# EAGLE design untitled (EAGLE 6.1)
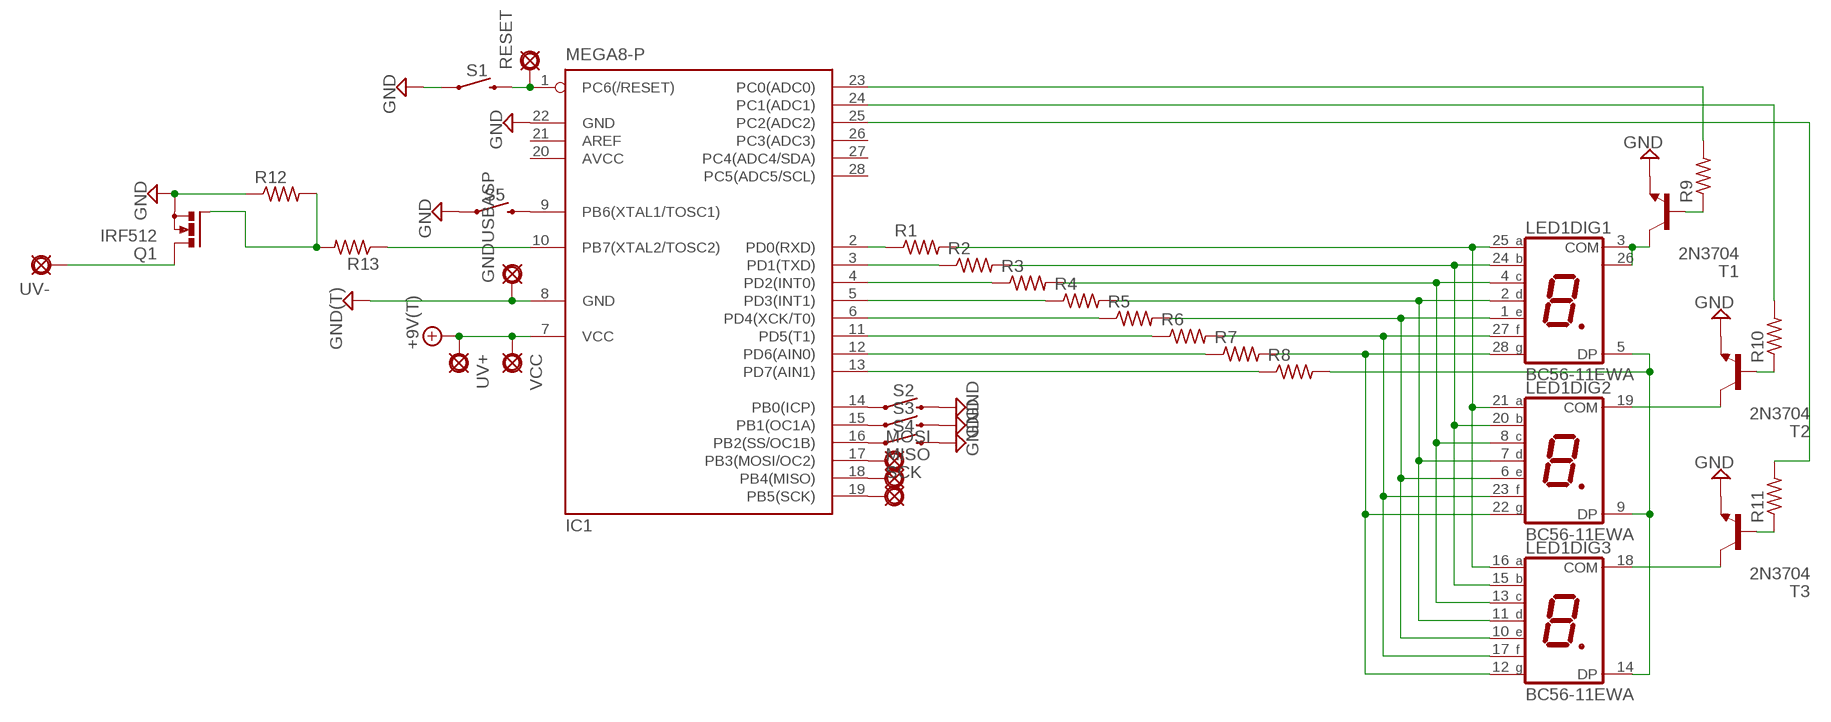
[diagram p0: schematic, sheet 1]

## Parts
+9V1  +9V(T)  [SQUARE]
GND1  GND(T)  [SQUARE]
GNDUSBASP  PAD  [SQUARE]
IC1  MEGA8-P  [DIL28-3]
LED1  BC56-11EWA  [BA/BC56]
MISO  PAD  [SQUARE]
MOSI  PAD  [SQUARE]
Q1  IRF512  [TO220BV]
R1  6MM.3  [R0207/3]
R2  6MM.3  [R0207/3]
R3  6MM.3  [R0207/3]
R4  6MM.3  [R0207/3]
R5  6MM.3  [R0207/3]
R6  6MM.3  [R0207/3]
R7  6MM.3  [R0207/3]
R8  6MM.3  [R0207/3]
R9  6MM.3  [R0207/3]
R10  6MM.3  [R0207/3]
R11  6MM.3  [R0207/3]
R12  6MM.3  [R0207/3]
R13  6MM.3  [R0207/3]
RESET  PAD  [SQUARE]
S1  MOMENTARY-SWITCH-SPST-PTH-6.0MM  [TACTILE_SWITCH_PTH_6.0MM]
S2  MOMENTARY-SWITCH-SPST-PTH-6.0MM  [TACTILE_SWITCH_PTH_6.0MM]
S3  MOMENTARY-SWITCH-SPST-PTH-6.0MM  [TACTILE_SWITCH_PTH_6.0MM]
S4  MOMENTARY-SWITCH-SPST-PTH-6.0MM  [TACTILE_SWITCH_PTH_6.0MM]
S5  MOMENTARY-SWITCH-SPST-PTH-6.0MM  [TACTILE_SWITCH_PTH_6.0MM]
SCK  PAD  [SQUARE]
T1  2N3704  [TO92]
T2  2N3704  [TO92]
T3  2N3704  [TO92]
UV+  PAD  [SQUARE]
UV-  PAD  [SQUARE]
VCC  PAD  [SQUARE]

## Nets
+9V: +9V1.1(+9V) IC1.7(VCC) UV+.1(PAD) VCC.1(PAD)
GND: GND1.1(GND) GNDUSBASP.1(PAD) IC1.8(GND) IC1.22(GND) Q1.S R12.1 S1.1 S2.3 S3.3 S4.3 S5.1 T1.3(E) T2.3(E) T3.3(E)
N$1: LED1.16(DIG3:A) LED1.21(DIG2:A) LED1.25(DIG1:A) R1.2
N$2: LED1.15(DIG3:B) LED1.20(DIG2:B) LED1.24(DIG1:B) R2.2
N$3: LED1.4(DIG1:C) LED1.8(DIG2:C) LED1.13(DIG3:C) R3.2
N$4: LED1.2(DIG1:D) LED1.7(DIG2:D) LED1.11(DIG3:D) R4.2
N$5: LED1.1(DIG1:E) LED1.6(DIG2:E) LED1.10(DIG3:E) R5.2
N$6: LED1.17(DIG3:F) LED1.23(DIG2:F) LED1.27(DIG1:F) R6.2
N$7: LED1.5(DIG1:DP) LED1.9(DIG2:DP) LED1.14(DIG3:DP) R8.2
N$8: LED1.12(DIG3:G) LED1.22(DIG2:G) LED1.28(DIG1:G) R7.2
N$9: LED1.3(DIG1:COM) LED1.26(DIG1:COM) T1.2(C)
N$10: LED1.19(DIG2:COM) T2.2(C)
N$11: LED1.18(DIG3:COM) T3.2(C)
N$12: IC1.2(PD0(RXD)) R1.1
N$13: IC1.3(PD1(TXD)) R2.1
N$14: IC1.4(PD2(INT0)) R3.1
N$15: IC1.5(PD3(INT1)) R4.1
N$16: IC1.6(PD4(XCK/T0)) R5.1
N$17: IC1.11(PD5(T1)) R6.1
N$18: IC1.12(PD6(AIN0)) R7.1
N$19: IC1.13(PD7(AIN1)) R8.1
N$20: R9.1 T1.1(B)
N$21: R10.1 T2.1(B)
N$22: R11.1 T3.1(B)
N$23: IC1.23(PC0(ADC0)) R9.2
N$24: IC1.24(PC1(ADC1)) R10.2
N$25: IC1.25(PC2(ADC2)) R11.2
N$26: IC1.1(PC6(/RESET)) RESET.1(PAD) S1.3
N$27: IC1.14(PB0(ICP)) S2.1
N$28: IC1.15(PB1(OC1A)) S3.1
N$29: IC1.16(PB2(SS/OC1B)) S4.1
N$30: IC1.9(PB6(XTAL1/TOSC1)) S5.3
N$31: IC1.17(PB3(MOSI/OC2)) MOSI.1(PAD)
N$32: IC1.18(PB4(MISO)) MISO.1(PAD)
N$33: IC1.19(PB5(SCK)) SCK.1(PAD)
N$34: IC1.10(PB7(XTAL2/TOSC2)) R13.1
N$35: Q1.G R12.2 R13.2
N$37: Q1.D UV-.1(PAD)
Unconnected: IC1.21(AREF) IC1.26(PC3(ADC3)) IC1.27(PC4(ADC4/SDA)) IC1.28(PC5(ADC5/SCL))

## Power pins joined to a net without a drawn wire
AVCC: IC1.20(AVCC)

## Library data of the parts
+9V1 = gm-supply:+9V(T): +9V Voltage Supply use this to hook up +9v throughout a schematic instead of running wire automatically labels the net "+9v" adds a hookup pad to the circuit board
GND1 = gm-supply:GND(T): Ground use this to hook up ground (GND) throughout a schematic instead of running wire automatically labels the net "GND" adds a hookup pad to the circuit board (you can use several)
GNDUSBASP MISO MOSI RESET SCK UV+ UV- VCC = gm-supply:PAD: PAD use this package for pads with any purpose, including input, output, send or return various pad shapes: round, square, octogonal, long, and long offset
IC1 = atmel:MEGA8-P: MICROCONTROLLER 8 Kbytes FLASH, 1 kbytes SRAM, 512 bytes EEPROM, USART, 4-channel 10 bit ADC, 2-channel 8 bit ADC Pin compatible with Atmega48, ATMega88, ATMega168 Source: avr.lbr; OC_FARNELL: unknown; OC_NEWARK: unknown
LED1 = display-kingbright:B?56-11*WA: 14.22mm (0.56INCH) THREE DIGIT NUMERIC DISPLAY Source: http://www.kingbright.com .. BA56-11EWA(Ver1189474895.pdf; OC_FARNELL: unknown; OC_NEWARK: unknown
Q1 = transistor-power:IRF512: N-CHANNEL MOS FET
R1-R13 = gm-resistors:6MM: 6mm Resistors Leads spaced 1-6 holes apart for 0.1" perfboard. Suitable for 1/4 watt resistors.
S1-S5 = SparkFun-Switches:MOMENTARY-SWITCH-SPST: Momentary Switch (Pushbutton) - SPST Normally-open (NO) SPST momentary switches (buttons, pushbuttons). Variants PTH-12MM - 12mm square, through-hole Momentary Pushbutton Switch - 12mm Square <https://www.sparkfun.com/products/9190> (COM-09190) PTH-6.0MM, PTH-6.0MM-KIT - 6.0mm square, through-hole Mini Pushbutton Switch <https://www.sparkfun.com/products/97> (COM-00097) KIT package intended for soldering kit's - only one side of pads' copper is exposed. PTH-RIGHT-ANGLE-KIT - Right-angle, through-hole Right Angle Tactile Button <https://www.sparkfun.com/products/10791> - Used on SparkFun BigTime Watch Kit <https://www.sparkfun.com/products/11734> SMD-12MM - 12mm square, surface-mount Tactile Button - SMD (12mm) <https://www.sparkfun.com/products/12993> (COM-12993) Used on SparkFun PicoBoard <https://www.sparkfun.com/products/11888> SMD-4.5MM - 4.5mm Square Trackball Switch Used on SparkFun Blackberry Trackballer Breakout <https://www.sparkfun.com/products/13169> SMD-4.6MMX2.8MM - 4.60mm x 2.80mm, surface mount Used on SparkFun SAMD21 Mini Breakout <https://www.sparkfun.com/products/13664> SMD-5.2MM, SMD-5.2-REDUNDANT - 5.2mm square, surface-mount Mini Pushbutton Switch - SMD <https://www.sparkfun.com/products/8720> (COM-08720) Used on Arduino Pro Mini <https://www.sparkfun.com/products/11114> REDUNDANT package connects both switch circuits together SMD-6.0X3.5MM - 6.0 x 3.5mm, surface mount Momentary Reset Switch SMD <https://www.sparkfun.com/products/8229> (COM-08229) SMD-6.2MM-TALL - 6.2mm square, surface mount Tactile Button - SMD (6mm) <https://www.sparkfun.com/products/12992> Used on SparkFun Digital Sandbox <https://www.sparkfun.com/products/12651> SMD-RIGHT-ANGLE - Right-angle, surface mount Used on SparkFun Block for Intel® Edison - Arduino <https://www.sparkfun.com/products/13036>; PROD_ID: SWCH-08441; SF_SKU: COM-00097
T1-T3 = transistor:2N3704: NPN TRANSISTOR

## Board
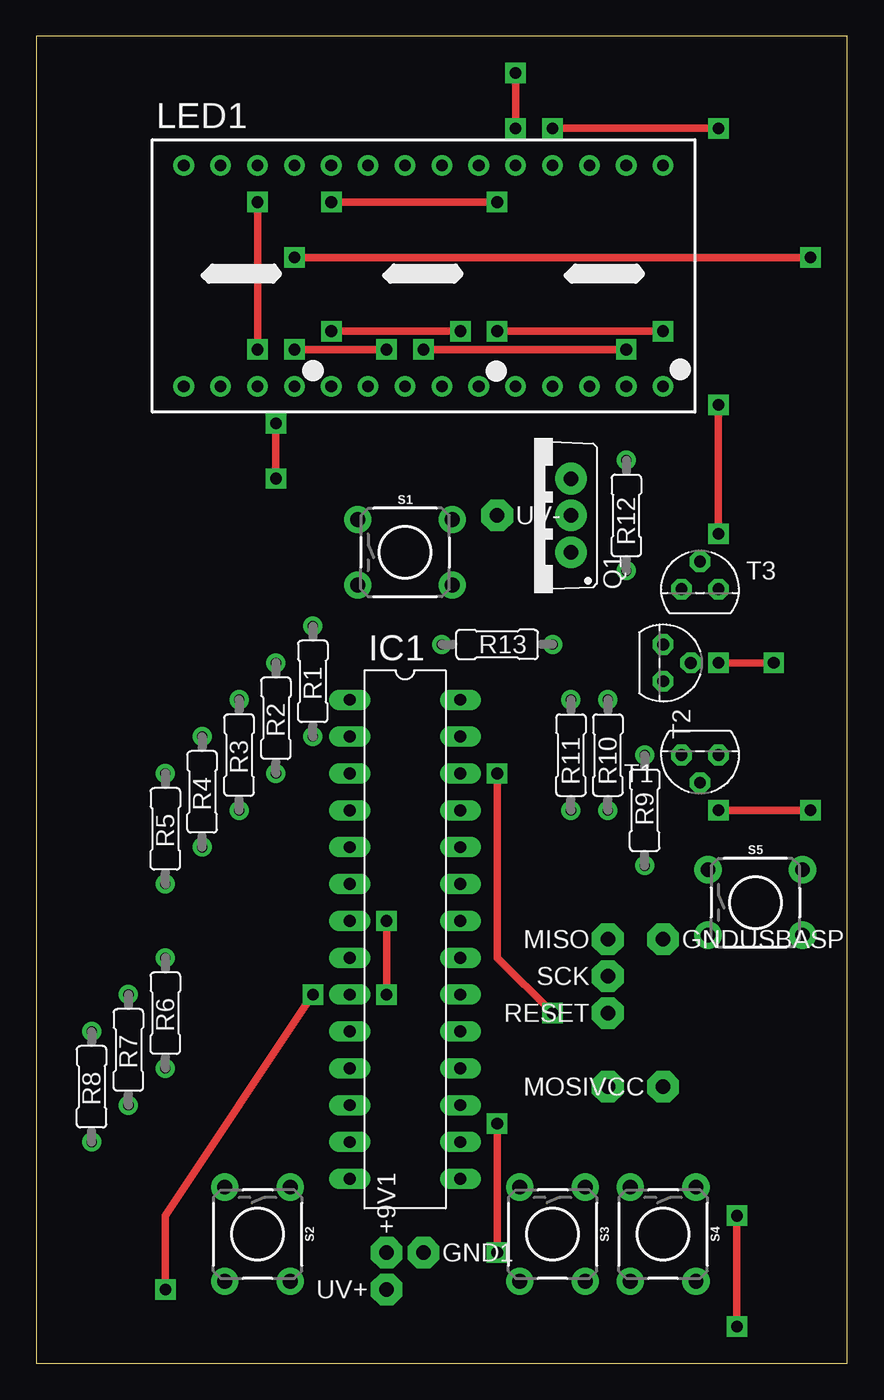
[diagram p1: board, top side]
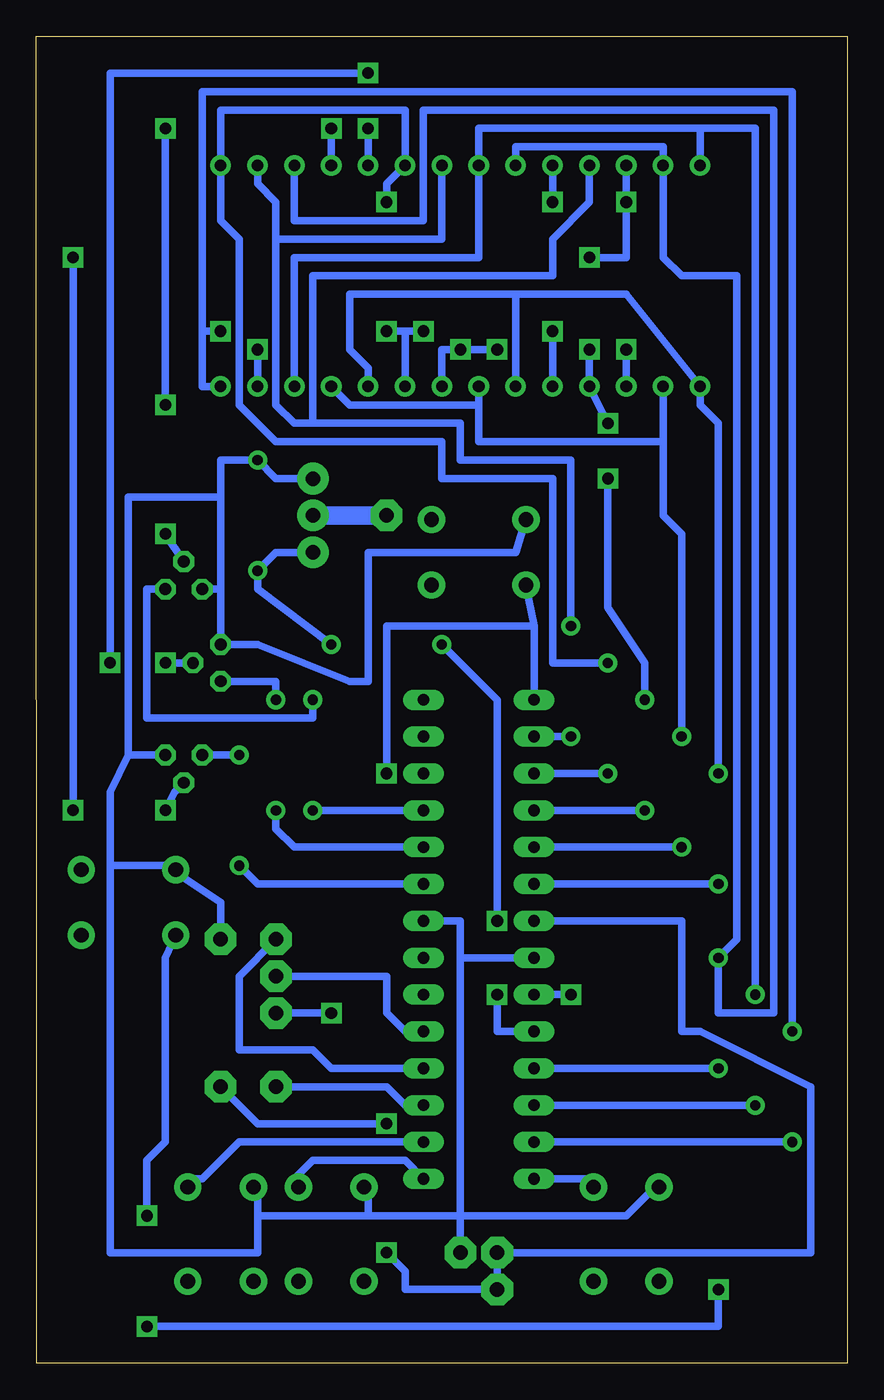
[diagram p2: board, bottom side, seen from below]

Size 55.88 x 91.44 mm. Coordinates in mm from the lower left corner, seen from the top.
Outline: 0,0 55.86,0 55.88,91.44 0,91.44 0,0
Copper layers (1*16): Top 0.035mm / dielectric 1.5mm / Bottom 0.035mm
Design rules: minimum track width 20mil, minimum drill 24mil, track to track 8mil, track to pad 8mil, pad to pad 8mil, via to via 8mil, smd to smd 8mil, copper to edge 20mil, drill to drill 40mil, minimum pad ring 12mil, minimum via ring 12mil, stop-mask expansion 4mil, vias tented up to drill 0mil, thermal gap 10mil

### Footprints (pad centres in the part's own frame; a part is rotated, then mirrored left to right if it is on the bottom)
SQUARE = drill 1 pad 2.18 octagon: 1 0,0
DIL28-3 = drill 0.813 long: 1 -16.51,-3.81; 2 -13.97,-3.81; 3 -11.43,-3.81; 4 -8.89,-3.81; 5 -6.35,-3.81; 6 -3.81,-3.81; 7 -1.27,-3.81; 8 1.27,-3.81; 9 3.81,-3.81; 10 6.35,-3.81; 11 8.89,-3.81; 12 11.43,-3.81; 13 13.97,-3.81; 14 16.51,-3.81; 15 16.51,3.81; 16 13.97,3.81; 17 11.43,3.81; 18 8.89,3.81; 19 6.35,3.81; 20 3.81,3.81; 21 1.27,3.81; 22 -1.27,3.81; 23 -3.81,3.81; 24 -6.35,3.81; 25 -8.89,3.81; 26 -11.43,3.81; 27 -13.97,3.81; 28 -16.51,3.81
BA/BC56 = drill 0.8 pad 1.422: 1 -16.51,-7.62; 2 -13.97,-7.62; 3 -11.43,-7.62; 4 -8.89,-7.62; 5 -6.35,-7.62; 6 -3.81,-7.62; 7 -1.27,-7.62; 8 1.27,-7.62; 9 3.81,-7.62; 10 6.35,-7.62; 11 8.89,-7.62; 12 11.43,-7.62; 13 13.97,-7.62; 14 16.51,-7.62; 15 16.51,7.62; 16 13.97,7.62; 17 11.43,7.62; 18 8.89,7.62; 19 6.35,7.62; 20 3.81,7.62; 21 1.27,7.62; 22 -1.27,7.62; 23 -3.81,7.62; 24 -6.35,7.62; 25 -8.89,7.62; 26 -11.43,7.62; 27 -13.97,7.62; 28 -16.51,7.62
TO220BV = drill 1 pad 2.18: D 0,-2.54; G -2.54,-2.54; S 2.54,-2.54
R0207/3 = drill 0.7: 1 -3.81,0; 2 3.81,0
TACTILE_SWITCH_PTH_6.0MM = drill 1.016 pad 1.88: 1 -3.251,2.261; 2 3.251,2.261; 3 -3.251,-2.261; 4 3.251,-2.261
TO92 = drill 0.813 octagon: 1 1.27,0; 2 0,1.905; 3 -1.27,0

### Placement (x,y rotation side)
+9V1  24.13,7.62 90 top
GND1  26.67,7.62 0 top
GNDUSBASP  43.18,29.21 0 top
IC1  25.4,29.21 270 top
LED1  26.67,74.93 0 top
MISO  39.37,29.21 180 top
MOSI  39.37,19.05 180 top
Q1  34.29,58.42 90 top
R1  19.05,46.99 90 top
R2  16.51,44.45 90 top
R3  13.97,41.91 90 top
R4  11.43,39.37 90 top
R5  8.89,36.83 90 top
R6  8.89,24.13 90 top
R7  6.35,21.59 90 top
R8  3.81,19.05 90 top
R9  41.91,38.1 270 top
R10  39.37,41.91 270 top
R11  36.83,41.91 270 top
R12  40.64,58.42 270 top
R13  31.75,49.53 0 top
RESET  39.37,24.13 180 top
S1  25.4,55.88 0 top
S2  15.24,8.89 270 top
S3  35.56,8.89 270 top
S4  43.18,8.89 270 top
S5  49.53,31.75 0 top
SCK  39.37,26.67 180 top
T1  45.72,41.91 180 top
T2  43.18,48.26 270 top
T3  45.72,53.34 0 top
UV+  24.13,5.08 180 top
UV-  31.75,58.42 0 top
VCC  43.18,19.05 180 top

### Tracks (layer width: path | path; a pad name or v marks a point on that pad's centre or on a via)
+9V  (via drill 0.8)
  Top 0.508: v31.75,16.51 v31.75,7.62
  Bottom 0.508: IC1.7 11.43,30.48 11.43,22.86 10.16,22.86 2.54,19.05 2.54,7.62 +9V1.1 UV+.1 30.48,5.08 30.48,6.35 v31.75,7.62 | VCC.1 40.64,16.51 v31.75,16.51
GND
  Bottom 0.508: IC1.22 26.67,30.48 26.67,27.94 | 33.02,10.16 26.67,10.16 | 26.67,10.16 15.24,10.16 12.7,12.7 S2.3 | 33.02,10.16 33.02,12.7 S3.3 | 40.64,11.43 40.64,12.7 S4.3 40.64,11.43 | 33.02,10.16 40.64,10.16 | 26.67,27.94 IC1.8 | 26.67,10.16 26.67,27.94 | 49.53,41.91 T1.3 | 43.18,59.69 49.53,59.69 49.53,41.91 | 43.18,53.34 43.18,59.69 | T3.3 43.18,53.34 | 43.18,53.34 T2.3 40.64,49.53 34.29,46.99 33.02,46.99 33.02,55.88 22.86,55.88 S1.1 | 46.99,34.29 43.18,31.75 GNDUSBASP.1 | 50.8,34.29 50.8,39.37 49.53,41.91 | 40.64,10.16 40.64,7.62 50.8,7.62 50.8,33.02 50.8,34.29 | 40.64,10.16 40.64,11.43 | GND1.1 26.67,10.16 | Q1.S 39.37,60.96 R12.1 43.18,62.23 43.18,59.69 | S5.1 46.71,34.01 46.99,34.29 | 46.99,34.29 50.8,34.29
N$1
  Bottom 0.508: R1.2 19.05,62.23 26.67,62.23 26.67,64.77 36.83,64.77 | 36.83,64.77 38.1,64.77 39.37,66.04 39.37,77.47 | LED1.16 40.64,81.28 39.37,80.01 39.37,77.47 | LED1.25 17.78,80.01 20.32,77.47 20.32,74.93 36.83,74.93 36.83,64.77 | LED1.21 27.94,77.47 39.37,77.47
N$2  (via drill 0.8)
  Top 0.508: v20.32,80.01 v31.75,80.01
  Bottom 0.508: R2.2 20.32,48.26 20.32,60.96 27.94,60.96 27.94,63.5 39.37,63.5 41.91,66.04 41.91,77.47 43.18,78.74 LED1.15 43.18,86.36 30.48,86.36 LED1.20 31.75,81.28 v31.75,80.01 | LED1.24 v20.32,80.01
N$3  (via drill 0.8)
  Top 0.508: v17.78,69.85 v24.13,69.85 | v26.67,69.85 v40.64,69.85 | v16.51,60.96 v16.51,64.77
  Bottom 0.508: LED1.8 27.94,69.85 v26.67,69.85 v24.13,69.85 | v40.64,69.85 LED1.13 | R3.2 13.97,48.26 16.51,52.07 v16.51,60.96 | v16.51,64.77 LED1.4 v17.78,69.85
N$4
  Bottom 0.508: LED1.2 12.7,63.5 | 12.7,63.5 12.7,58.42 11.43,57.15 R4.2 | 25.4,66.04 LED1.7 | 25.4,66.04 25.4,63.5 12.7,63.5 | LED1.11 34.29,66.04 25.4,66.04
N$5
  Bottom 0.508: 22.86,73.66 34.29,73.66 34.29,69.85 33.02,68.58 LED1.10 | R5.2 8.89,64.77 10.16,66.04 LED1.1 15.24,73.66 22.86,73.66 | 22.86,73.66 LED1.6
N$6
  Bottom 0.508: LED1.23 22.86,83.82 12.7,83.82 LED1.27 12.7,76.2 11.43,74.93 7.62,74.93 7.62,29.21 R6.2 8.89,24.13 5.08,24.13 5.08,86.36 29.21,86.36 29.21,78.74 38.1,78.74 LED1.17
N$7  (via drill 0.8)
  Top 0.508: v20.32,71.12 v29.21,71.12 | v31.75,71.12 v43.18,71.12
  Bottom 0.508: R8.2 3.81,87.63 44.45,87.63 44.45,71.12 | 44.45,71.12 44.45,67.31 LED1.14 | LED1.5 v20.32,71.12 | LED1.9 30.48,71.12 v31.75,71.12 v29.21,71.12 | v43.18,71.12 44.45,71.12
N$8
  Bottom 0.508: R7.2 6.35,85.09 10.16,85.09 | 10.16,85.09 LED1.28 10.16,83.82 | 10.16,85.09 25.4,85.09 LED1.22 25.4,76.2 38.1,76.2 LED1.12
N$9  (via drill 0.8)
  Top 0.508: v15.24,69.85 v15.24,80.01 | v46.99,38.1 v53.34,38.1 | v53.34,76.2 v17.78,76.2
  Bottom 0.508: LED1.3 v15.24,69.85 | T1.2 46.36,39.37 v46.99,38.1 | v53.34,38.1 v53.34,76.2 | v17.78,76.2 15.24,76.2 v15.24,80.01 LED1.26
N$10  (via drill 0.8)
  Top 0.508: v33.02,85.09 v33.02,88.9 | v50.8,48.26 v46.99,48.26
  Bottom 0.508: LED1.19 v33.02,85.09 | v33.02,88.9 50.8,88.9 v50.8,48.26 | v46.99,48.26 T2.2
N$11  (via drill 0.8)
  Top 0.508: v35.56,85.09 v46.99,85.09 | v46.99,66.04 v46.99,57.15
  Bottom 0.508: LED1.18 v35.56,85.09 | v46.99,85.09 v46.99,66.04 | v46.99,57.15 T3.2
N$12
  Bottom 0.508: IC1.2 R1.1
N$13
  Bottom 0.508: IC1.3 R2.1
N$14
  Bottom 0.508: IC1.4 R3.1
N$15
  Bottom 0.508: IC1.5 R4.1
N$16
  Bottom 0.508: IC1.6 R5.1
N$17
  Bottom 0.508: IC1.11 R6.1
N$18
  Bottom 0.508: IC1.12 R7.1
N$19
  Bottom 0.508: IC1.13 R8.1
N$20
  Bottom 0.508: T1.1 R9.1
N$21
  Bottom 0.508: R10.1 39.37,46.99 T2.1
N$22
  Bottom 0.508: R11.1 36.83,44.45 48.26,44.45 48.26,53.34 T3.1
N$23
  Bottom 0.508: IC1.23 40.64,33.02 R9.2
N$24
  Bottom 0.508: IC1.24 38.1,35.56 39.37,36.83 R10.2
N$25
  Bottom 0.508: IC1.25 R11.2
N$26  (via drill 0.8)
  Top 0.508: v31.75,40.64 31.75,27.94 v35.56,24.13
  Bottom 0.508: 21.59,50.8 S1.3 | IC1.1 21.59,50.8 | 21.59,50.8 31.75,50.8 v31.75,40.64 | v35.56,24.13 RESET.1
N$27
  Bottom 0.508: IC1.14 17.78,12.7 S2.1
N$28
  Bottom 0.508: IC1.15 30.48,13.97 36.83,13.97 38.1,12.7 S3.1
N$29
  Bottom 0.508: IC1.16 41.91,15.24 44.45,12.7 45.72,12.7 S4.1
N$30  (via drill 0.8)
  Top 0.508: v48.26,10.16 v48.26,2.54 | v8.89,5.08 8.89,10.16 v19.05,25.4
  Bottom 0.508: S5.3 46.99,27.94 46.99,15.24 48.26,13.97 v48.26,10.16 | v48.26,2.54 8.89,2.54 v8.89,5.08 | v19.05,25.4 IC1.9
N$31
  Bottom 0.508: IC1.17 30.48,17.78 31.75,19.05 MOSI.1
N$32
  Bottom 0.508: IC1.18 35.56,20.32 36.83,21.59 41.91,21.59 41.91,26.67 MISO.1
N$33
  Bottom 0.508: IC1.19 30.48,22.86 31.75,24.13 31.75,26.67 SCK.1
N$34  (via drill 0.8)
  Top 0.508: v24.13,25.4 v24.13,30.48
  Bottom 0.508: IC1.10 24.13,22.86 v24.13,25.4 | v24.13,30.48 24.13,45.72 R13.1
N$35
  Bottom 0.508: R13.2 40.64,53.34 R12.2 39.37,55.88 Q1.G
N$37
  Bottom 1.27: Q1.D UV-.1